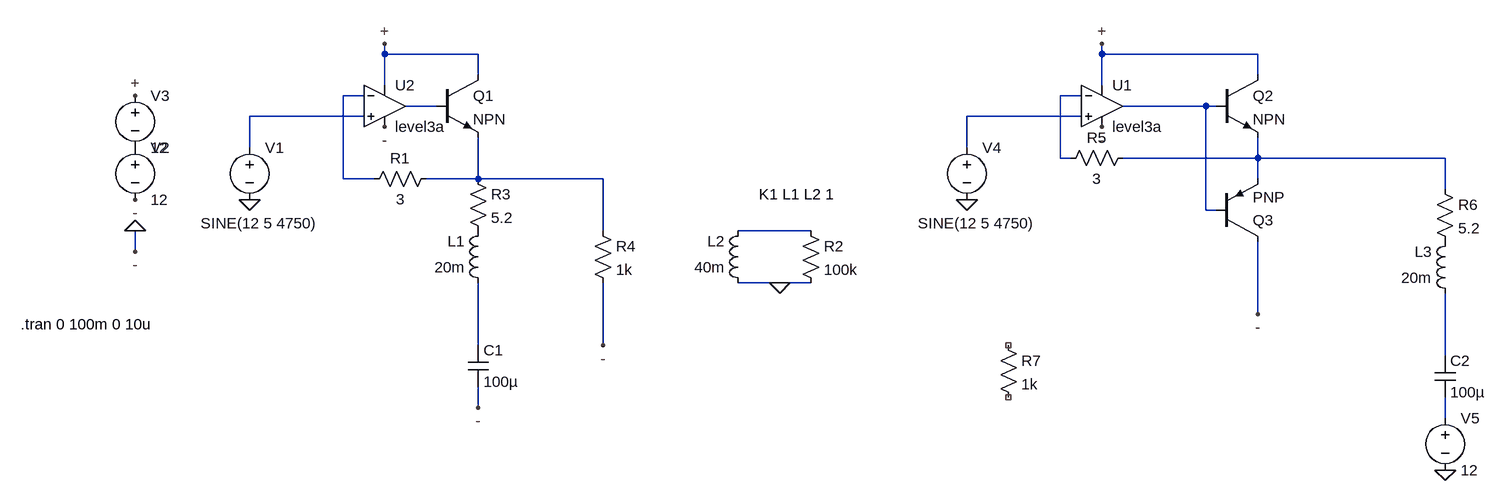
[diagram p0: schematic Draft3.asc]
Draft3.asc, the LTspice schematic file:
Version 4.1
SHEET 1 1992 680
WIRE 288 -32 288 -48
WIRE 432 -32 288 -32
WIRE 1392 -32 1392 -48
WIRE 1632 -32 1392 -32
WIRE 432 0 432 -32
WIRE 1632 0 1632 -32
WIRE 288 16 288 -32
WIRE 1392 16 1392 -32
WIRE 256 32 224 32
WIRE 1360 32 1328 32
WIRE 368 48 320 48
WIRE 1552 48 1424 48
WIRE 1568 48 1552 48
WIRE 256 64 80 64
WIRE 1360 64 1184 64
WIRE 80 112 80 64
WIRE 1184 112 1184 64
WIRE 1328 128 1328 32
WIRE 1344 128 1328 128
WIRE 1632 128 1632 96
WIRE 1632 128 1424 128
WIRE 1920 128 1632 128
WIRE 224 160 224 32
WIRE 272 160 224 160
WIRE 432 160 432 96
WIRE 432 160 352 160
WIRE 624 160 432 160
WIRE 1632 160 1632 128
WIRE 1920 176 1920 128
WIRE 1552 208 1552 48
WIRE 1568 208 1552 208
WIRE 624 240 624 160
WIRE 944 240 832 240
WIRE -96 272 -96 240
WIRE 896 320 832 320
WIRE 944 320 896 320
WIRE 1632 368 1632 256
WIRE 432 416 432 320
WIRE 624 416 624 320
WIRE 1920 432 1920 336
WIRE 432 512 432 480
WIRE 1920 528 1920 496
FLAG 80 192 0
FLAG -96 240 0
FLAG -96 192 -
FLAG 288 80 -
FLAG -96 32 +
FLAG 288 -48 +
FLAG 432 512 -
FLAG -96 272 -
FLAG 624 416 -
FLAG 896 320 0
FLAG 1184 192 0
FLAG 1392 80 -
FLAG 1392 -48 +
FLAG 1632 368 -
FLAG 1920 608 0
SYMBOL voltage 80 96 R0
WINDOW 3 -75 132 Left 2
WINDOW 123 0 0 Left 0
WINDOW 39 0 0 Left 0
SYMATTR InstName V1
SYMATTR Value SINE(12 5 4750)
SYMBOL lib\\sym\\ZZZ\\OpAmps\\UniversalOpamp3 288 48 R0
SYMATTR InstName U2
SYMBOL voltage -96 96 R0
WINDOW 123 0 0 Left 0
WINDOW 39 0 0 Left 0
SYMATTR InstName V2
SYMATTR Value 12
SYMBOL voltage -96 16 R0
WINDOW 123 0 0 Left 0
WINDOW 39 0 0 Left 0
SYMATTR InstName V3
SYMATTR Value 12
SYMBOL npn 368 0 R0
SYMATTR InstName Q1
SYMBOL res 368 144 R90
WINDOW 0 0 56 VBottom 2
WINDOW 3 32 56 VTop 2
SYMATTR InstName R1
SYMATTR Value 3
SYMBOL res 416 144 R0
SYMATTR InstName R3
SYMATTR Value 5.2
SYMBOL ind 448 336 R180
WINDOW 0 36 80 Left 2
WINDOW 3 36 40 Left 2
SYMATTR InstName L1
SYMATTR Value 20m
SYMATTR Type ind
SYMATTR SpiceLine Rser=1u
SYMBOL cap 416 416 R0
SYMATTR InstName C1
SYMATTR Value 100µ
SYMBOL res 608 224 R0
SYMATTR InstName R4
SYMATTR Value 1k
SYMBOL ind 848 336 R180
WINDOW 0 36 80 Left 2
WINDOW 3 36 40 Left 2
SYMATTR InstName L2
SYMATTR Value 40m
SYMATTR Type ind
SYMATTR SpiceLine Rser=5.1
SYMBOL res 928 224 R0
SYMATTR InstName R2
SYMATTR Value 100k
SYMBOL voltage 1184 96 R0
WINDOW 3 -75 132 Left 2
WINDOW 123 0 0 Left 0
WINDOW 39 0 0 Left 0
SYMATTR InstName V4
SYMATTR Value SINE(12 5 4750)
SYMBOL lib\\sym\\ZZZ\\OpAmps\\UniversalOpamp3 1392 48 R0
SYMATTR InstName U1
SYMBOL npn 1568 0 R0
SYMATTR InstName Q2
SYMBOL res 1328 144 R270
WINDOW 0 32 56 VTop 2
WINDOW 3 0 56 VBottom 2
SYMATTR InstName R5
SYMATTR Value 3
SYMBOL res 1904 160 R0
SYMATTR InstName R6
SYMATTR Value 5.2
SYMBOL ind 1936 352 R180
WINDOW 0 36 80 Left 2
WINDOW 3 36 40 Left 2
SYMATTR InstName L3
SYMATTR Value 20m
SYMATTR SpiceLine Rser=1u
SYMBOL cap 1904 432 R0
SYMATTR InstName C2
SYMATTR Value 100µ
SYMBOL res 1232 400 R0
SYMATTR InstName R7
SYMATTR Value 1k
SYMBOL pnp 1568 256 M180
SYMATTR InstName Q3
SYMBOL voltage 1920 512 R0
WINDOW 123 0 0 Left 0
WINDOW 39 0 0 Left 0
SYMATTR InstName V5
SYMATTR Value 12
TEXT -272 384 Left 2 !.tran 0 100m 0 10u
TEXT 864 184 Left 2 !K1 L1 L2 1

The netlist it stands for:
* Draft3.asc
V1 N005 0 SINE(12 5 4750)
X§U2 N005 N001 + 0 N003 level3a  ; pins In+ In- V+ V- OUT
V2 P001 0 12
V3 + P001 12
Q1 + N003 N008 0 NPN
R1 N008 N001 3
R3 N008 P002 5.2
L1 N010 P002 20m Rser=1u
C1 N010 0 100µ
R4 N008 0 1k
L2 0 N009 40m Rser=5.1
R2 N009 0 100k
V4 N006 0 SINE(12 5 4750)
X§U1 N006 N002 + 0 N004 level3a  ; pins In+ In- V+ V- OUT
Q2 + N004 N007 0 NPN
R5 N002 N007 3
R6 N007 P003 5.2
L3 N011 P003 20m Rser=1u
C2 N011 N012 100µ
R7 NC_01 NC_02 1k
Q3 0 N004 N007 0 PNP
V5 N012 0 12
.model NPN NPN
.model PNP PNP
.lib standard.bjt
.tran 0 100m 0 10u
K1 L1 L2 1
.backanno
.end